# Altium schematic sheet 2_P1.schdoc.schdoc
size 309 x 223 mm; Symbol: Sheet-Symbol_A4; Device: Sheet-Symbol_A4; Company: Tianjin University; Drawed: Xiang Chang; Reviewed: Xiang Chang; Version: V2.0; Page Size: A4; @Project Name: 柔性爪二代; @Page Count: 2; @Update Date: 2024-11-28; @Create Date: 2024-03-04; @Schematic Name: Schematic1; @Page No: 1; @Page Name: P1
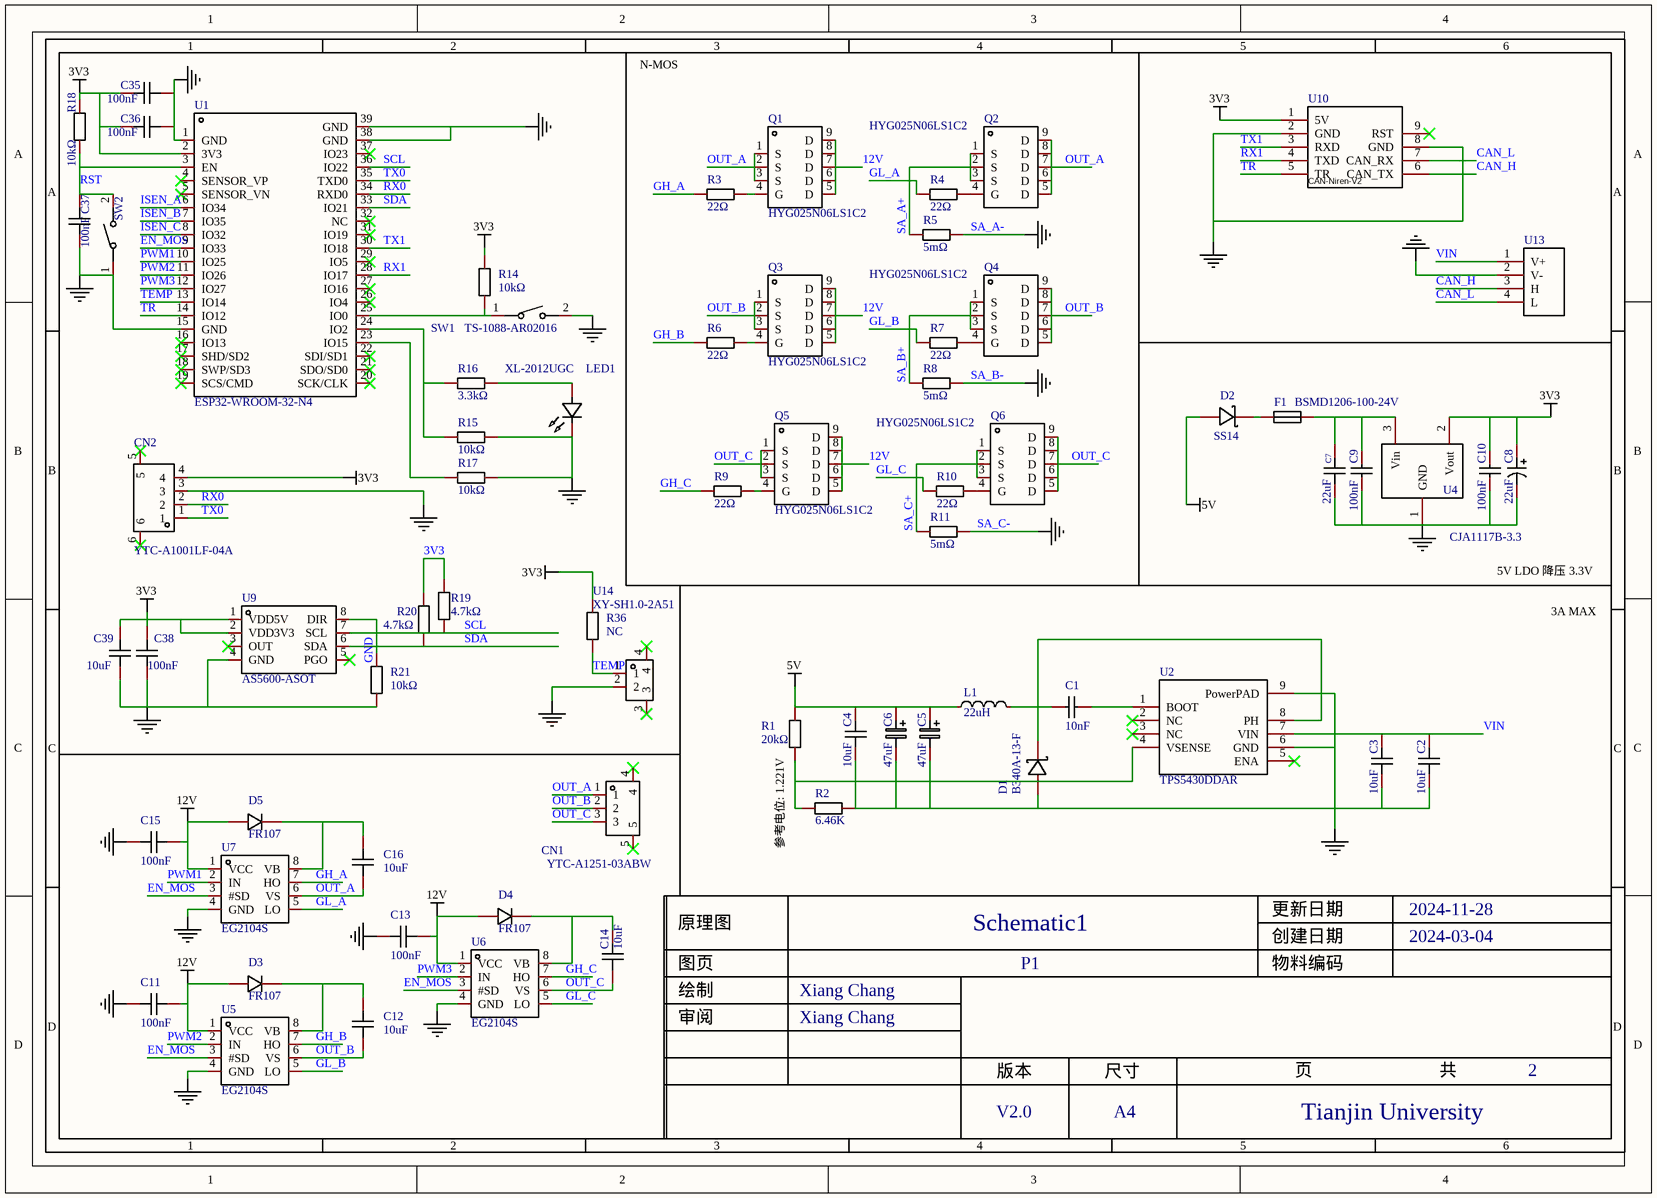
[diagram p0: 2_P1.schdoc.schdoc]

## Parts
C1  10nF  [C0603]
C2  10uF  [C0805]
C3  10uF  [C0805]
C4  10uF  [C0805]
C5  47uF  [CAP-SMD_L3.5-W2.8-R-RD]
C6  47uF  [CAP-SMD_L3.5-W2.8-R-RD]
C7  22uF  [C0603]
C8  22uF  [CAP-SMD_L3.2-W1.6]
C9  100nF  [C0402]
C10  100nF  [C0402]
C11  100nF  [C0603]
C12  10uF  [C0805]
C13  100nF  [C0603]
C14  10uF  [C0805]
C15  100nF  [C0603]
C16  10uF  [C0805]
C35  100nF  [C0603]
C36  100nF  [C0603]
C37  100nF  [C0603]
C38  100nF  [C0603]
C39  10uF  [C0805]
CN1  YTC-A1251-03ABW  [CONN-SMD_3P-P1.25_YTC-A1251-03ABW]
CN2  YTC-A1001LF-04A  [CONN-TH_YTC-A1001LF-04A]
D1  B340A-13-F  [SMA_L4.4-W2.6-LS5.0-RD]
D2  SS14  [SMA_L4.2-W2.6-LS5.3-RD]
D3  FR107  [SOD-123_L2.8-W1.8-LS3.7-RD]
D4  FR107  [SOD-123_L2.8-W1.8-LS3.7-RD]
D5  FR107  [SOD-123_L2.8-W1.8-LS3.7-RD]
F1  BSMD1206-100-24V  [F1206]
L1  22uH  [IND-SMD_L7.0-W6.6_FXL0630]
LED1  XL-2012UGC  [LED0805-RD_GREEN]
Q1  HYG025N06LS1C2  [DFN-8_L5.9-W5.2-P1.27-LS6.2-BL]
Q2  HYG025N06LS1C2  [DFN-8_L5.9-W5.2-P1.27-LS6.2-BL]
Q3  HYG025N06LS1C2  [DFN-8_L5.9-W5.2-P1.27-LS6.2-BL]
Q4  HYG025N06LS1C2  [DFN-8_L5.9-W5.2-P1.27-LS6.2-BL]
Q5  HYG025N06LS1C2  [DFN-8_L5.9-W5.2-P1.27-LS6.2-BL]
Q6  HYG025N06LS1C2  [DFN-8_L5.9-W5.2-P1.27-LS6.2-BL]
R1  20kΩ  [R0603]
R2  6.46K  [R0603]
R3  22Ω  [R0603]
R4  22Ω  [R0603]
R5  5mΩ  [RES-SMD_L6.4-W3.2-1]
R6  22Ω  [R0603]
R7  22Ω  [R0603]
R8  5mΩ  [RES-SMD_L6.4-W3.2-1]
R9  22Ω  [R0603]
R10  22Ω  [R0603]
R11  5mΩ  [RES-SMD_L6.4-W3.2-1]
R14  10kΩ  [R0603]
R15  10kΩ  [R0603]
R16  3.3kΩ  [R0603]
R17  10kΩ  [R0603]
R18  10kΩ  [R0603]
R19  4.7kΩ  [R0603]
R20  4.7kΩ  [R0603]
R21  10kΩ  [R0603]
R36  NC  [R0603]
SW1  TS-1088-AR02016  [SW-SMD_L3.9-W3.0-P4.45]
SW2  TS-1088-AR02016  [SW-SMD_L3.9-W3.0-P4.45]  (value not drawn)
U1  ESP32-WROOM-32-N4  [WIFIM-SMD_ESP32-WROOM-32-N4]
U2  TPS5430DDAR  [ESOP-8_L4.9-W3.9-P1.27-LS6.0-TL-EP]
U4  CJA1117B-3.3  [SOT-89-3_L4.5-W2.5-P1.50-LS4.2-BR]
U5  EG2104S  [SOIC-8_L5.0-W4.0-P1.27-LS6.0-BL]
U6  EG2104S  [SOIC-8_L5.0-W4.0-P1.27-LS6.0-BL]
U7  EG2104S  [SOIC-8_L5.0-W4.0-P1.27-LS6.0-BL]
U9  AS5600-ASOT  [SOIC-8_L5.0-W4.0-P1.27-LS6.0-BL]
U10  CAN-Niren-V2  [CAN-Niren-V2]
U13  XT30PB(2+2)-M  [XT30PB(2+2)-M]  (value not drawn)
U14  XY-SH1.0-2A51  [CONN-SMD_2P-P1.00_XY-SH1.0-2A51]

## Nets
3V3: C8.1 C10.2 C35.1 C36.1 C38.2 C39.2 CN2.4 R14.2 R18.2 R19.2 R20.2 R36.2 U1.2(3V3) U4.2(Vout) U9.1(VDD5V) U9.2(VDD3V3) U10.1(5V)
5V: C4.2 C5.1 C6.1 D2.2(A) L1.1 R1.2
12V: C11.2 C13.2 C15.2 D3.2(A) D4.2(A) D5.2(A) Q1.5(D) Q1.6(D) Q1.7(D) Q1.8(D) Q1.9(D) Q3.5(D) Q3.6(D) Q3.7(D) Q3.8(D) Q3.9(D) Q5.5(D) Q5.6(D) Q5.7(D) Q5.8(D) Q5.9(D) U5.1(VCC) U6.1(VCC) U7.1(VCC)
SA_A-: C2.1 C3.1 C4.1 C5.2 C6.2 C7.2 C8.2 C9.1 C10.1 C11.1 C13.1 C15.1 C35.2 C36.2 C37.1 C38.1 C39.1 CN2.3 D1.2(A) LED1.1(K) R2.1 R5.1 R8.1 R11.1 R15.2 R17.2 R21.1 SW1.2 SW2.1 U1.1(GND) U1.15(GND) U1.38(GND) U1.39(GND) U2.6(GND) U2.9(PowerPAD) U4.1(GND) U5.4(GND) U6.4(GND) U7.4(GND) U9.4(GND) U10.2(GND) U10.8(GND) U13.2(V-) U14.2  [also labelled GND, SA_B-, SA_C-]
CAN_H: U10.6(CAN_TX) U13.3(H)
CAN_L: U10.7(CAN_RX) U13.4(L)
EN_MOS: U1.9(IO33) U5.3(#SD) U6.3(#SD) U7.3(#SD)
GH_A: R3.1 U7.7(HO)
GH_B: R6.1 U5.7(HO)
GH_C: R9.1 U6.7(HO)
GL_A: R4.1 U7.5(LO)
GL_B: R7.1 U5.5(LO)
GL_C: R10.1 U6.5(LO)
ISEN_A: U1.6(IO34)
ISEN_B: U1.7(IO35)
ISEN_C: U1.8(IO32)
OUT_A: C16.1 CN1.1 Q1.1(S) Q1.2(S) Q1.3(S) Q2.5(D) Q2.6(D) Q2.7(D) Q2.8(D) Q2.9(D) U7.6(VS)
OUT_B: C12.1 CN1.2 Q3.1(S) Q3.2(S) Q3.3(S) Q4.5(D) Q4.6(D) Q4.7(D) Q4.8(D) Q4.9(D) U5.6(VS)
OUT_C: C14.1 CN1.3 Q5.1(S) Q5.2(S) Q5.3(S) Q6.5(D) Q6.6(D) Q6.7(D) Q6.8(D) Q6.9(D) U6.6(VS)
PWM1: U1.10(IO25) U7.2(IN)
PWM2: U1.11(IO26) U5.2(IN)
PWM3: U1.12(IO27) U6.2(IN)
RST: C37.2 R18.1 SW2.2 U1.3(EN)
RX0: CN2.2 U1.34(RXD0)
RX1: U1.28(IO17) U10.4(TXD)
SA_A+: Q2.1(S) Q2.2(S) Q2.3(S) R5.2
SA_B+: Q4.1(S) Q4.2(S) Q4.3(S) R8.2
SA_C+: Q6.1(S) Q6.2(S) Q6.3(S) R11.2
SCL: R19.1 U1.36(IO22) U9.7(SCL)
SDA: R20.1 U1.33(IO21) U9.6(SDA)
TEMP: R36.1 U1.13(IO14) U14.1
TR: U1.14(IO12) U10.5(TR)
TX0: CN2.1 U1.35(TXD0)
TX1: U1.30(IO18) U10.3(RXD)
VIN: C2.2 C3.2 U2.7(VIN) U13.1(V+)
NetC1_1: C1.1 D1.1(K) L1.2 U2.8(PH)
NetC1_2: C1.2 U2.1(BOOT)
NetC7_1: C7.1 C9.2 F1.2 U4.3(Vin)
NetC12_2: C12.2 D3.1(K) U5.8(VB)
NetC14_2: C14.2 D4.1(K) U6.8(VB)
NetC16_2: C16.2 D5.1(K) U7.8(VB)
NetD2_1: D2.1(K) F1.1
NetLED1_2: LED1.2(A) R16.2
NetQ1_4: Q1.4(G) R3.2
NetQ2_4: Q2.4(G) R4.2
NetQ3_4: Q3.4(G) R6.2
NetQ4_4: Q4.4(G) R7.2
NetQ5_4: Q5.4(G) R9.2
NetQ6_4: Q6.4(G) R10.2
NetR1_1: R1.1 R2.2 U2.4(VSENSE)
NetR14_1: R14.1 SW1.1 U1.25(IO0)
NetR15_1: R15.1 R16.1 U1.24(IO2)
NetR17_1: R17.1 U1.23(IO15)
NetR21_2: R21.2 U9.8(DIR)

Not connected (* = marked no-connect by the designer): CN1 4* 5*; CN2 5* 6*; U1 4(SENSOR_VP)* 5(SENSOR_VN)* 16(IO13)* 17(SHD/SD2)* 18(SWP/SD3)* 19(SCS/CMD)* 20(SCK/CLK)* 21(SDO/SD0)* 22(SDI/SD1)* 26(IO4)* 27(IO16)* 29(IO5)* 31(IO19)* 32(NC)* 37(IO23)*; U2 2(NC)* 3(NC)* 5(ENA)*; U9 3(OUT)* 5(PGO)*; U10 9(RST)*; U14 3* 4*

## Notes on the sheet
- N-MOS
- 5V LDO 降压 3.3V
- 3A MAX
- 参考电位: 1.221V
- Labels drawn without touching a wire or pin: GND
- 1
- 2
- 3
- 4
- 5
- 6
- A
- B
- C
- 原理图
- Schematic1
- 创建日期
- 更新日期
- 2024-11-28
- 2024-03-04
- 审阅
- 绘制
- 图页
- Xiang Chang
- P1
- 物料编码
- D
- 版本
- 尺寸
- 页
- 共
- V2.0
- A4
- Tianjin University

## Library data of the parts
C1 = CC0603KRX7R9BB103: Manufacturer: YAGEO(国巨); Add into BOM: yes; Tolerance: ±10%; Voltage Rated: 50V; Temperature Coefficient: X7R; Description: 容值:10nF;精度:±10%;额定电压:50V;材质(温度系数):X7R;; Name: 10nF; Symbol: CC0603KRX7R9BB103; Device: CC0603KRX7R9BB103; Supplier: LCSC; Manufacturer Part: CC0603KRX7R9BB103; Value: 10nF; Supplier Part: C100042; JLCPCB Part Class: Extended Part; LCSC Part Name: 10nF ±10% 50V; Supplier Footprint: 0603; Datasheet: https://atta.szlcsc.com/upload/public/pdf/source/20181008/C309510_22F155564471FAF6A489F7D68F34234E.pdf; Convert to PCB: yes
C2 = GRM21BR61H106KE43L: Manufacturer: muRata(村田); Symbol: FS55X226K500EHG; Add into BOM: yes; Tolerance: ±10%; Voltage Rated: 50V; Temperature Coefficient: X5R; Description: 容值:10uF;精度:±10%;额定电压:50V;材质(温度系数):X5R;; Name: 10uF; Device: GRM21BR61H106KE43L; Supplier: LCSC; Supplier Part: C440198; Manufacturer Part: GRM21BR61H106KE43L; Value: 10uF; JLCPCB Part Class: Basic Part; LCSC Part Name: 10uF ±10% 50V; Supplier Footprint: 0805; Datasheet: https://atta.szlcsc.com/upload/public/pdf/source/20230811/95AAE0C9AF55EDC31B7A4D8B733F534E.pdf; Convert to PCB: yes
C3 C4 = GRM21BR61H106KE43L: Manufacturer: muRata(村田); Add into BOM: yes; Tolerance: ±10%; Voltage Rated: 50V; Temperature Coefficient: X5R; Description: 容值:10uF;精度:±10%;额定电压:50V;材质(温度系数):X5R;; Name: 10uF; Symbol: GRM21BR61H106KE43L; Device: GRM21BR61H106KE43L; Supplier: LCSC; Supplier Part: C440198; Manufacturer Part: GRM21BR61H106KE43L; Value: 10uF; JLCPCB Part Class: Basic Part; LCSC Part Name: 10uF ±10% 50V; Supplier Footprint: 0805; Datasheet: https://atta.szlcsc.com/upload/public/pdf/source/20230811/95AAE0C9AF55EDC31B7A4D8B733F534E.pdf; Convert to PCB: yes
C5 C6 = CA45-B-16V-47uF-K: Manufacturer: CEC(振华新云); Add into BOM: yes; Tolerance: ±10%; Rated Voltage: 16V; Equivalent Series Resistance(ESR): 3Ω@100kHz; Description: 容值:47uF;精度:±10%;额定电压:16V;等效串联电阻:3Ω@100kHz;; Name: 47uF; Symbol: CA45-B-16V-47UF-K; Device: CA45-B-16V-47uF-K; LCSC Part Name: 47uF ±10% 16V; Supplier Part: C136751; Manufacturer Part: CA45-B-16V-47uF-K; Supplier Footprint: CASE-B-3528; JLCPCB Part Class: Extended Part; Datasheet: https://atta.szlcsc.com/upload/public/pdf/source/20200817/C136751_89CB14FC7BB434027D9410E248BC6FA3.pdf; Supplier: LCSC; Convert to PCB: yes; Value: 47uF; Operating Temperature: -55℃~+125℃
C7 = CL10A226MO7JZNC: Manufacturer: SAMSUNG(三星); Add into BOM: yes; Tolerance: ±20%; Voltage Rated: 16V; Temperature Coefficient: X5R; Description: 容值:22uF;精度:±20%;额定电压:16V;材质(温度系数):X5R;; Name: 22uF; Symbol: CL10A226MO7JZNC; Device: CL10A226MO7JZNC; Supplier: LCSC; Supplier Part: C2762594; Manufacturer Part: CL10A226MO7JZNC; Value: 22uF; JLCPCB Part Class: 扩展库; LCSC Part Name: 22uF ±20% 16V; Supplier Footprint: 0603; Datasheet: https://atta.szlcsc.com/upload/public/pdf/source/20220811/0832C3B1C642040B023B7A6186895861.pdf; Convert to PCB: yes
C8 = CA45-A-16V-22uF-K: Manufacturer: CEC(振华新云); Add into BOM: yes; Tolerance: ±10%; Rated Voltage: 16V; Equivalent Series Resistance(ESR): 6Ω@100kHz; Description: 容值:22uF;精度:±10%;额定电压:16V;等效串联电阻:6Ω@100kHz;; Name: 22uF; Symbol: CA45-A-16V-22UF-K; Device: CA45-A-16V-22uF-K; LCSC Part Name: 22uF ±10% 16V; Supplier Part: C782264; Manufacturer Part: CA45-A-16V-22uF-K; Supplier Footprint: CASE-A-3216; JLCPCB Part Class: 扩展库; Datasheet: https://atta.szlcsc.com/upload/public/pdf/source/20200909/C782264_D6D9C4EF3B25E81633C26A9294FBB820.pdf; Supplier: LCSC; Convert to PCB: yes; Value: 22uF; Operating Temperature: -55℃~+125℃
C9 C10 = CL05B104KB54PNC: Manufacturer: SAMSUNG(三星); Symbol: cl10b104ko8nnnc; Add into BOM: yes; Tolerance: ±10%; Voltage Rated: 50V; Temperature Coefficient: X7R; Description: 容值:100nF;精度:±10%;额定电压:50V;材质(温度系数):X7R;; Name: 100nF; Device: CL05B104KB54PNC; Supplier: LCSC; Manufacturer Part: CL05B104KB54PNC; Value: 100nF; Supplier Part: C307331; JLCPCB Part Class: Basic Part; LCSC Part Name: 100nF ±10% 50V; Supplier Footprint: 0402; Datasheet: https://atta.szlcsc.com/upload/public/pdf/source/20181009/C307331_222F7C870FD3EA5F46F538B483443886.pdf; Convert to PCB: yes
C11 C13 C15 C35-C37 = 0603B104K500NT: Manufacturer: FH(风华); Symbol: CapAcitance; Add into BOM: yes; Tolerance: ±10%; Voltage Rated: 50V; Temperature Coefficient: X7R; Description: 容值:100nF;精度:±10%;额定电压:50V;材质(温度系数):X7R;; Name: 100nF; Device: 0603B104K500NT; LCSC Part Name: 100nF ±10% 50V; Supplier Part: C30926; Manufacturer Part: 0603B104K500NT; Supplier Footprint: 0603; JLCPCB Part Class: Extended Part; Datasheet: https://atta.szlcsc.com/upload/public/pdf/source/20200305/C486355_26A10D38EF8C2A5C37091D0039909270.pdf; Supplier: LCSC; Convert to PCB: yes; Value: 100nF
C12 C14 C16 C39 = GRM21BR61H106KE43L: Manufacturer: muRata(村田); Symbol: CapAcitance; Add into BOM: yes; Tolerance: ±10%; Voltage Rated: 50V; Temperature Coefficient: X5R; Description: 容值:10uF;精度:±10%;额定电压:50V;材质(温度系数):X5R;; Name: 10uF; Device: GRM21BR61H106KE43L; LCSC Part Name: 10uF ±10% 50V; Supplier Part: C440198; Manufacturer Part: GRM21BR61H106KE43L; Supplier Footprint: 0805; JLCPCB Part Class: Basic Part; Datasheet: https://atta.szlcsc.com/upload/public/pdf/source/20230811/95AAE0C9AF55EDC31B7A4D8B733F534E.pdf; Supplier: LCSC; Convert to PCB: yes; Value: 10uF
C38 = CC0603KRX7R9BB104: Manufacturer: YAGEO(国巨); Add into BOM: yes; Tolerance: ±10%; Voltage Rated: 50V; Temperature Coefficient: X7R; Description: 容值:100nF;精度:±10%;额定电压:50V;材质(温度系数):X7R;; Name: 100nF; Symbol: CC0603KRX7R9BB104; Device: CC0603KRX7R9BB104; Supplier: LCSC; Manufacturer Part: CC0603KRX7R9BB104; Value: 100nF; Supplier Part: C14663; JLCPCB Part Class: 基础库; LCSC Part Name: 100nF ±10% 50V; Supplier Footprint: 0603; Datasheet: https://atta.szlcsc.com/upload/public/pdf/source/20180910/C282072_33301C7F631E79921B82A8DAC6BCC5B3.pdf; Convert to PCB: yes
CN1 = YTC-A1251-03ABW: Manufacturer: YIYUAN(怡远); Add into BOM: yes; Pins Structure: 1x3P; Pitch: 1.25mm; Number of PINs Per Row: 3; Current Rating (Max): 1A; Description: 插针结构:1x3P;间距:1.25mm;安装方式:卧贴;总PIN数:3P;排数:1;每排PIN数:3;额定电流:1A;工作温度范围:-25℃~+85℃;; Name: YTC-A1251-03ABW; Symbol: YTC-A1251-03ABW; Device: YTC-A1251-03ABW; LCSC Part Name: 1.25mm 1x3P卧贴; Supplier Part: C7436576; Manufacturer Part: YTC-A1251-03ABW; Supplier Footprint: P=1.25mm; JLCPCB Part Class: 扩展库; Datasheet: https://atta.szlcsc.com/upload/public/pdf/source/20230703/1435987A1D1278BD8E0276EA6FE76C2F.pdf; Supplier: LCSC; Convert to PCB: yes; Mounting Style: 卧贴; Number of Pins: 3P; Number of Rows: 1; Operating Temperature Range: -25℃~+85℃
CN2 = YTC-A1001LF-04A: Manufacturer: YIYUAN(怡远); Symbol: HC-1.0-4PWT; Add into BOM: yes; Pins Structure: 1x4P; Pitch: 1mm; Number of PINs Per Row: 4; Current Rating (Max): 1A; Description: 插针结构:1x4P;间距:1mm;安装方式:立贴;总PIN数:4P;排数:1;每排PIN数:4;额定电流:1A;工作温度范围:-25℃~+85℃;; Name: YTC-A1001LF-04A; Device: YTC-A1001LF-04A; LCSC Part Name: 1.0mm 1x4P立贴; Supplier Part: C7436582; Manufacturer Part: YTC-A1001LF-04A; Supplier Footprint: P=1mm; JLCPCB Part Class: Extended Part; Datasheet: https://atta.szlcsc.com/upload/public/pdf/source/20230703/56840124B43913079BB2E5DAB1E22112.pdf; Supplier: LCSC; Convert to PCB: yes; Mounting Style: 立贴; Number of Pins: 4P; Number of Rows: 1; Operating Temperature Range: -25℃~+85℃; Reference Series: -; Row Spacing: -; Contact Material: 磷青铜; Contact Plating: 锡
D1 = B340A-13-F: Manufacturer: DIODES(美台); Add into BOM: yes; Forward Voltage (Vf@If): 500mV@3A; Reverse Voltage (Vr): 40V; Average Rectified Current (Io): 3A; Reverse Leakage Current (Ir): 500uA@40V; Description: 正向压降(Vf):500mV@3A;直流反向耐压(Vr):40V;平均整流电流(Io):3A;; Name: B340A-13-F; Symbol: B340A-13-F; Device: B340A-13-F; LCSC Part Name: 电压:40V 电流:3A; Supplier Part: C85098; Manufacturer Part: B340A-13-F; Supplier Footprint: SMA(DO-214AC); JLCPCB Part Class: Extended Part; Datasheet: https://atta.szlcsc.com/upload/public/pdf/source/20171023/C134454_15087453575121052549.pdf; Supplier: LCSC; Convert to PCB: yes
D2 = SS14_C2480: Manufacturer: MDD; Add into BOM: yes; Diode Configuration: 独立式; Forward Voltage (Vf@If): 550mV@1A; Reverse Voltage (Vr): 40V; Average Rectified Current (Io): 1A; Reverse Leakage Current (Ir): 500uA@40V; Description: 二极管配置:独立式;正向压降(Vf):550mV@1A;直流反向耐压(Vr):40V;平均整流电流(Io):1A;; Name: SS14; Symbol: SS14; Device: SS14_C2480; Supplier: LCSC; Manufacturer Part: SS14; Supplier Part: C2480; JLCPCB Part Class: 基础库; LCSC Part Name: 电压:40V 电流:1A; Supplier Footprint: SMA(DO-214AC); Datasheet: https://atta.szlcsc.com/upload/public/pdf/source/20230712/2DB6064CFBB99DE6DB116BEE8208BE66.pdf; Convert to PCB: yes
D3-D5 = FR107_C511885: Manufacturer: BORN(伯恩半导体); Add into BOM: yes; Forward Voltage (Vf@If): 1.3V@1A; Reverse Voltage (Vr): 1kV; Average Rectified Current (Io): 1A; Reverse Leakage Current: 5uA@1kV; Reverse Recovery Time (trr): 500ns; Description: 二极管配置:-;正向压降(Vf):1.3V@1A;直流反向耐压(Vr):1kV;平均整流电流(Io):1A;反向恢复时间(trr):500ns;; Name: FR107; Symbol: FR107_C511885; Device: FR107_C511885; Supplier: LCSC; Supplier Part: C511885; Manufacturer Part: FR107; JLCPCB Part Class: Extended Part; LCSC Part Name: 电压:1kV 电流:1A; Supplier Footprint: SOD-123; Datasheet: https://atta.szlcsc.com/upload/public/pdf/source/20200413/C511885_F5BBF7A87475723E74BE0D118A106A7A.pdf; Convert to PCB: yes; Diode Configuration: -; Operating Temperature: -55℃~+150℃@(Tj)
F1 = BSMD1206-100-24V: Manufacturer: BHFUSE(佰宏); Add into BOM: yes; Operating Voltage (Max): 24V; Current Rating (Max): 40A; Hold Current: 1A; Trip Current: 1.8A; Power Dissipation: 1W; Resistance - Initial (Ri) (Min): 50mΩ; Resistance - Post Trip (R1) (Max): 270mΩ; Maximum Time to Trip: 300ms; Description: 最大电压:24V;最大电流:40A;保持电流:1A;跳闸电流:1.8A;; Name: BSMD1206-100-24V; Symbol: BSMD1206-100-24V; Device: BSMD1206-100-24V; Supplier: LCSC; Supplier Part: C910830; Manufacturer Part: BSMD1206-100-24V; JLCPCB Part Class: 扩展库; LCSC Part Name: 1206 1A 24V 佰宏高电压; Supplier Footprint: 1206; Datasheet: https://atta.szlcsc.com/upload/public/pdf/source/20230512/E419278EC8529AAF514173EF221BCF4B.pdf; Convert to PCB: yes; Operating Temperature: -40℃~+85℃
L1 = FXL0630-220-M: Manufacturer: cjiang(长江微电); Add into BOM: yes; Tolerance: ±20%; Rated Current: 2.5A; Saturation Current (Isat): 3A; DC Resistance (DCR): 200mΩ; Type: 一体成型电感; Description: 电感值:22uH;精度:±20%;额定电流:2.5A;饱和电流(Isat):3A;类型:一体成型电感;; Name: 22uH; Symbol: FXL0630-220-M; Device: FXL0630-220-M; LCSC Part Name: 22uH ±20% 3A; Supplier Part: C177244; Manufacturer Part: FXL0630-220-M; Supplier Footprint: SMD,6.6x7mm; JLCPCB Part Class: Extended Part; Datasheet: https://atta.szlcsc.com/upload/public/pdf/source/20230516/3A080F5AF8C87BB81C3BA86E5F60E51A.pdf; Supplier: LCSC; Convert to PCB: yes; Value: 22uH
LED1 = XL-2012UGC: Manufacturer: XINGLIGHT(成兴光); Add into BOM: yes; Emitted Color: 翠绿色; Power Dissipation: 80mW; Forward Current: 25mA; Dominant Wavelength: 516nm~525nm; Peak Wavelength: 534nm; Lens Color: 无色透明透镜; Viewing Angle: 120°; Mounting Sytle: 正贴; Description: 发光颜色:翠绿色;功率:80mW;正向电流:25mA;主波长:516nm~525nm;透镜颜色:无色透明透镜;色温:-;发光角度:120°;载带方式:正贴;工作温度:-30℃~+85℃;; Name: XL-2012UGC; Symbol: XL-2012UGC; Device: XL-2012UGC; Supplier: LCSC; Supplier Part: C965815; Manufacturer Part: XL-2012UGC; JLCPCB Part Class: 扩展库; LCSC Part Name: XL-2012UGC; Supplier Footprint: 0805; Datasheet: https://atta.szlcsc.com/upload/public/pdf/source/20221102/ACA6CBC413A1A8AF38BEBA54306464BE.pdf; Convert to PCB: yes; Color Temperature: -; Operating Temperature: -30℃~+85℃
Q1-Q6 = HYG025N06LS1C2: Manufacturer: HUAYI(华羿微); Add into BOM: yes; Type: N沟道; Drain Source Voltage (Vdss): 60V; Continuous Drain Current (Id): 170A; Power Dissipation (Pd): 130W; Drain Source On Resistance (RDS(on)@Vgs,Id): 2.1mΩ@10V,20A; Gate Threshold Voltage (Vgs(th)@Id): 2.1V@250uA; Total Gate Charge (Qg@Vgs): 28.2nC@10V; Input Capacitance (Ciss@Vds): 3.915nF@25V; Reverse Transfer Capacitance (Crss@Vds): 10.2pF@25V; Description: 类型:N沟道;漏源电压(Vdss):60V;连续漏极电流(Id):170A;功率(Pd):130W;导通电阻(RDS(on)@Vgs,Id):2.1mΩ@10V,20A;阈值电压(Vgs(th)@Id):2.1V@250uA;; Name: HYG025N06LS1C2; Symbol: HYG025N06LS1C2; Device: HYG025N06LS1C2; Supplier: LCSC; Supplier Part: C2827231; Manufacturer Part: HYG025N06LS1C2; JLCPCB Part Class: Extended Part; LCSC Part Name: N沟道 耐压:60V 电流:170A; Supplier Footprint: DFN-8(5.2x5.9); Datasheet: https://atta.szlcsc.com/upload/public/pdf/source/20210419/C2827231_13841C0339ED96AF58AC5A6C3EF7CB2D.pdf; Convert to PCB: yes; Operating Temperature: -
R1 = 0603WAF2002T5E: Manufacturer: UNI-ROYAL(厚声); Symbol: 电阻; Add into BOM: yes; Tolerance: ±1%; Power(Watts): 100mW; Overload Voltage (Max): 75V; Temperature Coefficient: ±100ppm/℃; Description: 电阻类型:厚膜电阻;阻值:20kΩ;精度:±1%;功率:100mW;最大工作电压:75V;温度系数:±100ppm/℃;; Name: 20kΩ; Device: 0603WAF2002T5E; LCSC Part Name: 20kΩ ±1% 100mW 厚膜电阻; Supplier Part: C4184; Manufacturer Part: 0603WAF2002T5E; Supplier Footprint: 0603; JLCPCB Part Class: Basic Part; Datasheet: https://atta.szlcsc.com/upload/public/pdf/source/20200306/C422600_1E6D84923E4A46A82E41ADD87F860B5C.pdf; Supplier: LCSC; Convert to PCB: yes; Type: 厚膜电阻; Value: 20kΩ; Operating Temperature Range: -55℃~+155℃
R2 = Res_0603: Symbol: 电阻; Convert to PCB: yes; Standardization Check: false; Name: 6.46K; Device: Res_0603; Add into BOM: yes; Supplier Footprint: 0603; Value: 6.46K
R3 R4 R6 R7 R9 R10 = 0603WAF220JT5E: Manufacturer: UNI-ROYAL(厚声); Symbol: 电阻; Add into BOM: yes; Tolerance: ±1%; Power(Watts): 100mW; Overload Voltage (Max): 75V; Temperature Coefficient: ±100ppm/℃; Description: 电阻类型:厚膜电阻;阻值:22Ω;精度:±1%;功率:100mW;最大工作电压:75V;温度系数:±100ppm/℃;; Name: 22Ω; Device: 0603WAF220JT5E; LCSC Part Name: 22Ω ±1% 100mW 厚膜电阻; Supplier Part: C23345; Manufacturer Part: 0603WAF220JT5E; Supplier Footprint: 0603; JLCPCB Part Class: Basic Part; Datasheet: https://atta.szlcsc.com/upload/public/pdf/source/20200306/C422600_1E6D84923E4A46A82E41ADD87F860B5C.pdf; Supplier: LCSC; Convert to PCB: yes; Type: 厚膜电阻; Value: 22Ω; Operating Temperature Range: -55℃~+155℃
R5 R8 R11 = RLP25FEGMR005: Manufacturer: 大毅科技; Symbol: 电阻; Add into BOM: yes; Tolerance: ±1%; Power(Watts): 3W; Temperature Coefficient: ±50ppm/℃; Mounting Sytle: 贴片; Description: 电阻类型:采样电阻;阻值:5mΩ;精度:±1%;额定压降:-;功率:3W;温度系数:±50ppm/℃;安装方式:贴片;; Name: 5mΩ; Device: RLP25FEGMR005; LCSC Part Name: 5mΩ ±1% 3W; Supplier Part: C393074; Manufacturer Part: RLP25FEGMR005; Supplier Footprint: 2512; JLCPCB Part Class: Extended Part; Datasheet: https://atta.szlcsc.com/upload/public/pdf/source/20191016/C437152_56BA2D1CA54CB05F65C989188AF9FC43.pdf; Supplier: LCSC; Convert to PCB: yes; Type: 采样电阻; Value: 5mΩ; Rated Output Voltage: -; Rated Current: -
R14 R15 R17 R18 R21 = 0603WAF1002T5E: Manufacturer: UNI-ROYAL(厚声); Symbol: 电阻; Add into BOM: yes; Tolerance: ±1%; Power(Watts): 100mW; Overload Voltage (Max): 75V; Temperature Coefficient: ±100ppm/℃; Description: 电阻类型:厚膜电阻;阻值:10kΩ;精度:±1%;功率:100mW;最大工作电压:75V;温度系数:±100ppm/℃;; Name: 10kΩ; Device: 0603WAF1002T5E; LCSC Part Name: 厚膜电阻 10kΩ ±1% 100mW; Supplier Part: C25804; Manufacturer Part: 0603WAF1002T5E; Supplier Footprint: 0603; JLCPCB Part Class: Basic Part; Datasheet: https://atta.szlcsc.com/upload/public/pdf/source/20200306/C422600_1E6D84923E4A46A82E41ADD87F860B5C.pdf; Supplier: LCSC; Convert to PCB: yes; Type: 厚膜电阻; Value: 10kΩ; Operating Temperature Range: -55℃~+155℃
R16 = 0603WAF3301T5E: Manufacturer: UNI-ROYAL(厚声); Symbol: 电阻; Add into BOM: yes; Tolerance: ±1%; Power(Watts): 100mW; Overload Voltage (Max): 75V; Temperature Coefficient: ±100ppm/℃; Description: 电阻类型:厚膜电阻;阻值:3.3kΩ;精度:±1%;功率:100mW;最大工作电压:75V;温度系数:±100ppm/℃;; Name: 3.3kΩ; Device: 0603WAF3301T5E; LCSC Part Name: 3.3kΩ ±1% 100mW 厚膜电阻; Supplier Part: C22978; Manufacturer Part: 0603WAF3301T5E; Supplier Footprint: 0603; JLCPCB Part Class: Basic Part; Datasheet: https://atta.szlcsc.com/upload/public/pdf/source/20200306/C422600_1E6D84923E4A46A82E41ADD87F860B5C.pdf; Supplier: LCSC; Convert to PCB: yes; Type: 厚膜电阻; Value: 3.3kΩ; Operating Temperature Range: -55℃~+155℃
R19 R20 = 0603WAF4701T5E: Manufacturer: UNI-ROYAL(厚声); Add into BOM: yes; Tolerance: ±1%; Power(Watts): 100mW; Overload Voltage (Max): 75V; Temperature Coefficient: ±100ppm/℃; Description: 阻值:4.7kΩ;精度:±1%;功率:100mW;温度系数:±100ppm/℃;电阻类型:厚膜电阻;; Name: 4.7kΩ; Symbol: 0603WAF4701T5E; Device: 0603WAF4701T5E; Supplier: LCSC; Manufacturer Part: 0603WAF4701T5E; Supplier Part: C23162; Value: 4.7kΩ; JLCPCB Part Class: Basic Part; LCSC Part Name: 4.7kΩ ±1% 100mW 厚膜电阻; Supplier Footprint: 0603; Datasheet: https://atta.szlcsc.com/upload/public/pdf/source/20200306/C422600_1E6D84923E4A46A82E41ADD87F860B5C.pdf; Convert to PCB: yes; Type: 厚膜电阻; Operating Temperature Range: -55℃~+155℃
R36 = Res_0603: Symbol: 电阻; Convert to PCB: yes; Name: NC; Device: Res_0603; Add into BOM: yes; Supplier Footprint: 0603; Value: NC
SW1 SW2 = TS-1088-AR02016: Manufacturer: XUNPU(讯普); Add into BOM: yes; Circuit: 单刀单掷; Actuator Style: 圆形按钮; Operating Force: 160gf; Switch Length: 4mm; Switch Width: 3mm; Switch Height: 2mm; Strike Gundam: 不带; Contact Current: 50mA; Voltage Rating (DC): 12V; Insulation Resistance: 100MΩ; Actuator/Cap Color: 黑色; Pin Style: SMD接片; Mechanical Life: 10万次; Description: 电路结构:单刀单掷;按钮形状:圆形按钮;作用力:160gf;安装方式:立贴;开关长度:4mm;开关宽度:3mm;开关高度:2mm;带支架:不带;触点电流:50mA;额定电压(DC):12V;绝缘电阻:100MΩ;机械寿命:10万次;; Name: TS-1088-AR02016; Symbol: TS-1088-AR02016; Device: TS-1088-AR02016; Supplier: LCSC; Supplier Part: C720477; Manufacturer Part: TS-1088-AR02016; JLCPCB Part Class: 扩展库; LCSC Part Name: 4*3*2mm 立贴 轻触开关; Supplier Footprint: SMD; Datasheet: https://atta.szlcsc.com/upload/public/pdf/source/20200810/C720475_60D09DD6C54279ADDB2DC25100F1CC11.pdf; Convert to PCB: yes; Mounting Style: 立贴; Operating Temperature: -30℃~+80℃
U1 = ESP32-WROOM-32-N4: Manufacturer: ESPRESSIF(乐鑫); Add into BOM: yes; Description: WiFi+蓝牙4.2+双核CPU,ESP32; Name: ESP32-WROOM-32-N4; Symbol: ESP32-WROOM-32; Device: ESP32-WROOM-32-N4; Supplier: LCSC; Supplier Part: C82899; Manufacturer Part: ESP32-WROOM-32-N4; JLCPCB Part Class: Extended Part; LCSC Part Name: WiFi+蓝牙4.2+双核CPU模块; Supplier Footprint: SMD,18x25.5mm; Datasheet: https://atta.szlcsc.com/upload/public/pdf/source/20210719/C82899_2D52724B6FAFABC419BCF308C5944296.pdf; Convert to PCB: yes
U2 = TPS5430DDAR: Manufacturer: TI(德州仪器); Add into BOM: yes; Function: 降压型; Output Type: 可调; Input Voltage: 5.5V~36V; Output Voltage: 1.221V~32.04V; Output Current (Max): 3A; Switching Frequency: 500kHz; Synchronous Rectification: 否; Number of Outputs: 1; Topology: 降压式; Switch tube (built-in/external): 内置; Description: 功能类型:降压型;输出类型:可调;输入电压:5.5V~36V;输出电压:1.221V~32.04V;输出电流(最大值):3A;; Name: TPS5430DDAR; Symbol: TPS5430DDAR; Device: TPS5430DDAR; LCSC Part Name: 降压 3A 36V; Supplier Part: C9864; Manufacturer Part: TPS5430DDAR; Supplier Footprint: SOIC-8-EP; JLCPCB Part Class: 基础库; Datasheet: https://www.ti.com/cn/lit/gpn/tps5430; Supplier: LCSC; Convert to PCB: yes; Operating Temperature: -40℃~+125℃@(TJ)
U4 = CJA1117B-3.3: Manufacturer: CJ(江苏长电/长晶); Add into BOM: yes; Output Type: 固定; Maximum Input Voltage: 15V; Output Voltage: 3.3V; Output Current: 1A; Power Supply Rejection Ratio (PSRR): 75dB@(120Hz); Dropout Voltage: 1.3V@(1A); Output Polarity: 正; Number of Outputs: 1; Description: 输出类型:固定;最大输入电压:15V;输出电压:3.3V;输出电流:1A;电源纹波抑制比(PSRR):75dB@(120Hz);输出极性:正;; Name: CJA1117B-3.3; Symbol: CJA1117B-3.3; Device: CJA1117B-3.3; Supplier: LCSC; Manufacturer Part: CJA1117B-3.3; Supplier Part: C24253; JLCPCB Part Class: Extended Part; LCSC Part Name: 输入15V 输出3.3V 1A; Supplier Footprint: SOT-89-3; Datasheet: https://atta.szlcsc.com/upload/public/pdf/source/20170719/C107222_1500457721357828222.pdf; Convert to PCB: yes
U5-U7 = EG2104S: Manufacturer: EG(屹晶微); Add into BOM: yes; Name: EG2104S; Symbol: EG2104S; Device: EG2104S; Supplier: LCSC; Supplier Part: C480652; Manufacturer Part: EG2104S; JLCPCB Part Class: Extended Part; LCSC Part Name: EG2104S; Supplier Footprint: SOIC-8; Datasheet: https://atta.szlcsc.com/upload/public/pdf/source/20200107/C480652_F6747CE49A4141A3459309A1DCCBEFEE.pdf; Convert to PCB: yes
U9 = AS5600-ASOT: Manufacturer: ams(艾迈斯半导体); Add into BOM: yes; Name: AS5600-ASOT; Symbol: AS5600-ASOT; Device: AS5600-ASOT; LCSC Part Name: AS5600-ASOT; Supplier Part: C499458; Manufacturer Part: AS5600-ASOT; Supplier Footprint: SOIC-8; JLCPCB Part Class: Extended Part; Datasheet: https://atta.szlcsc.com/upload/public/pdf/source/20200324/C499458_E1461AFB0CE1042DE5756821C534625C.pdf; Supplier: LCSC; Convert to PCB: yes
U10 = CAN-Niren-V2: Add into BOM: yes; Standardization Check: false; Symbol: CAN-Niren-V2; Device: CAN-Niren-V2; Convert to PCB: yes; Description: CAN-Niren-V2
U13 = XT30PB(2+2)-M: Add into BOM: yes; Standardization Check: false; Symbol: XT30PB(2+2)-M; Device: XT30PB(2+2)-M; Convert to PCB: yes
U14 = XY-SH1.0-2A51: Manufacturer: XYECONN(辛译); Add into BOM: yes; Pins Structure: 1x2P; Pitch: 1mm; Number of PINs Per Row: 2; Description: 插针结构:1x2P;间距:1mm;安装方式:立贴;总PIN数:2P;排数:1;每排PIN数:2;; Name: XY-SH1.0-2A51; Symbol: XY-SH1.0-2A51; Device: XY-SH1.0-2A51; Supplier: LCSC; Supplier Part: C19272005; Manufacturer Part: XY-SH1.0-2A51; LCSC Part Name: 间距:1.0 1x2P 立贴; Supplier Footprint: SMD,P=1mm; Datasheet: https://atta.szlcsc.com/upload/public/pdf/source/20231128/C6B60C64F4338683BC8BC065CCF39725.pdf; Convert to PCB: yes; Mounting Style: 立贴; Number of Pins: 2P; Number of Rows: 1